# Altium schematic sheet config_headers.SchDoc
size A4; SheetNumber: 4; SheetTotal: 5
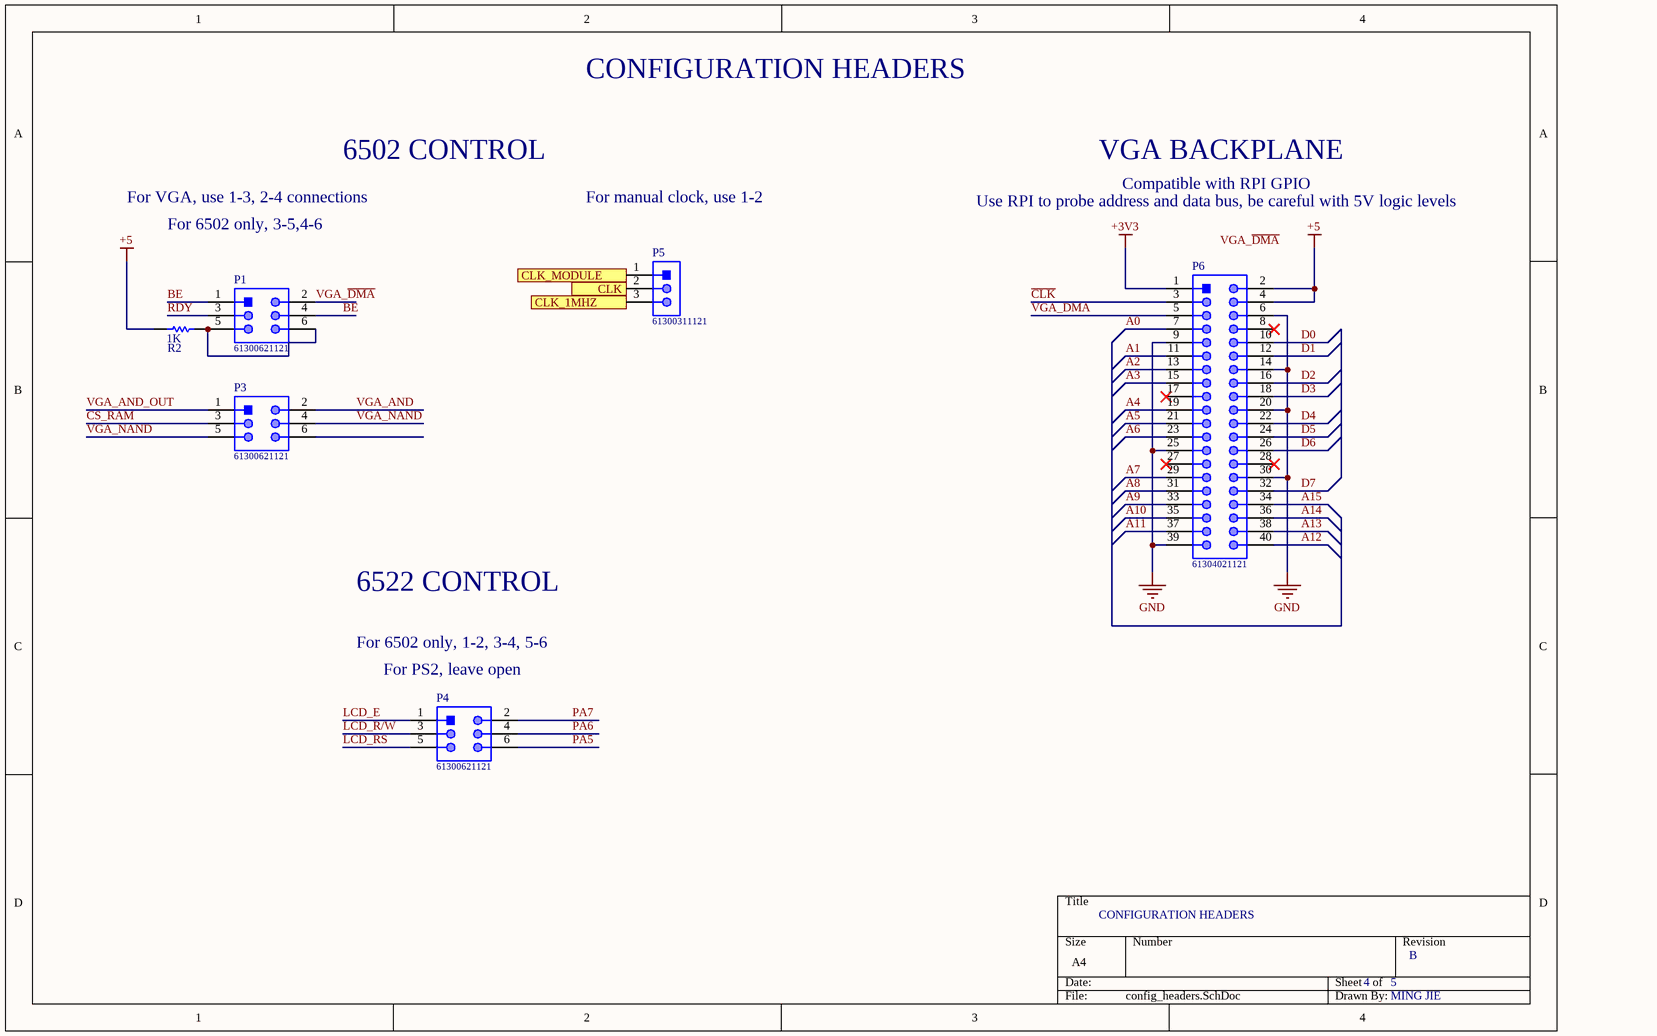
[diagram p0: config_headers.SchDoc]

## Parts
P1  61300621121  [61300621121]
P3  61300621121  [61300621121]
P4  61300621121  [61300621121]
P5  61300311121  [61300311121]
P6  61304021121  [61304021121]
R2  Resistance: 1K  [RESC2013X50X30NL20T20]  (hidden comment: CRCW08051K00FKEA)

## Ports
CLK (in), CLK_1MHZ (out), CLK_MODULE (out)

## Nets
+3V3: P6.1
+5: P6.2 P6.4 R2.1
GND: P6.6 P6.9 P6.14 P6.20 P6.25 P6.30 P6.39
A0: P6.7
A1: P6.11
A2: P6.13
A3: P6.15
A4: P6.19
A5: P6.21
A6: P6.23
A7: P6.29
A8: P6.31
A9: P6.33
A10: P6.35
A11: P6.37
A12: P6.40
A13: P6.38
A14: P6.36
A15: P6.34
BE: P1.1 P1.4
~{CLK}: P6.3
~{CS}_RAM: P3.3
CLK: P5.2 ; port CLK
CLK_1MHZ: P5.3 ; port CLK_1MHZ
CLK_MODULE: P5.1 ; port CLK_MODULE
D0: P6.10
D1: P6.12
D2: P6.16
D3: P6.18
D4: P6.22
D5: P6.24
D6: P6.26
D7: P6.32
LCD_E: P4.1
LCD_R/~{W}: P4.3
LCD_RS: P4.5
PA5: P4.6
PA6: P4.4
PA7: P4.2
RDY: P1.3
VGA_AND: P3.2
VGA_AND_OUT: P3.1
VGA_~{DMA}: P1.2 P6.5
VGA_NAND: P3.4 P3.5
NetP1_5: P1.5 P1.6 R2.2

Not connected (* = marked no-connect by the designer): P3 6; P6 8* 17* 27* 28*

## Notes on the sheet
- CONFIGURATION HEADERS
- 6502 CONTROL
- VGA BACKPLANE
- For VGA, use 1-3, 2-4 connections
- For 6502 only, 3-5,4-6
- For manual clock, use 1-2
- Use RPI to probe address and data bus, be careful with 5V logic levels
- Compatible with RPI GPIO
- 6522 CONTROL
- For 6502 only, 1-2, 3-4, 5-6
- (near P4) For PS2, leave open
- 4
- 5
- B
- MING JIE
- Labels drawn without touching a wire or pin: VGA_~{DMA}

## Library data of the parts
P1 P3 P4 = CMP-1502-01072-1: THT Vertical Pin Header WR-PHD, Pitch 2.54 mm, Dual Row, 6 pins; Manufacturer: Wurth Elektronik; Contact Resistance: 20mOhm; Withstanding Voltage: 500VAC; Pin Number: 6; Gender: Male; Pitch: 2.54mm; Working Voltage: 250VAC; Rated Current: 3A; Packaging: Bag; Row Number: Dual; Manufacturer URL: http://www.we-online.de; Part Number: 61300621121; Operating Temperature: -40to105degC; Mounting Technology: THT; Package Reference: 61300621121; Datasheet URL: https://katalog.we-online.de/em/datasheet/6130xx21121.pdf; Orientation: Vertical; Publisher: WurthElektronik
P5 = CMP-1502-01062-1: THT Vertical Pin Header WR-PHD, Pitch 2.54 mm, Single Row, 3 pins; Manufacturer: Wurth Elektronik; Withstanding Voltage: 500VAC; Working Voltage: 250VAC; Rated Current: 3A; Pitch: 2.54mm; Pin Number: 3; Gender: Male; Contact Resistance: 20mOhm; Package Reference: 61300311121; Manufacturer URL: http://www.we-online.de; Datasheet URL: https://katalog.we-online.de/em/datasheet/6130xx11121.pdf; Operating Temperature: -40to105degC; Part Number: 61300311121; Orientation: Vertical; Packaging: Bag; Row Number: Single; Mounting Technology: THT; Publisher: WurthElektronik
P6 = CMP-1502-01135-1: THT Vertical Pin Header WR-PHD, Pitch 2.54 mm, Dual Row, 40 pins; Manufacturer: Wurth Elektronik; Contact Resistance: 20mOhm; Pitch: 2.54mm; Pin Number: 40; Withstanding Voltage: 500VAC; Gender: Male; Rated Current: 3A; Working Voltage: 250VAC; Operating Temperature: -40to105degC; Manufacturer URL: http://www.we-online.de; Orientation: Vertical; Datasheet URL: https://katalog.we-online.de/em/datasheet/6130xx21121.pdf; Package Reference: 61304021121; Row Number: Dual; Part Number: 61304021121; Packaging: Bag; Mounting Technology: THT; Publisher: WurthElektronik
R2 = CMP-1013-00510-2: Manufacturer: Vishay Dale; Part Number: CRCW08051K00FKEA